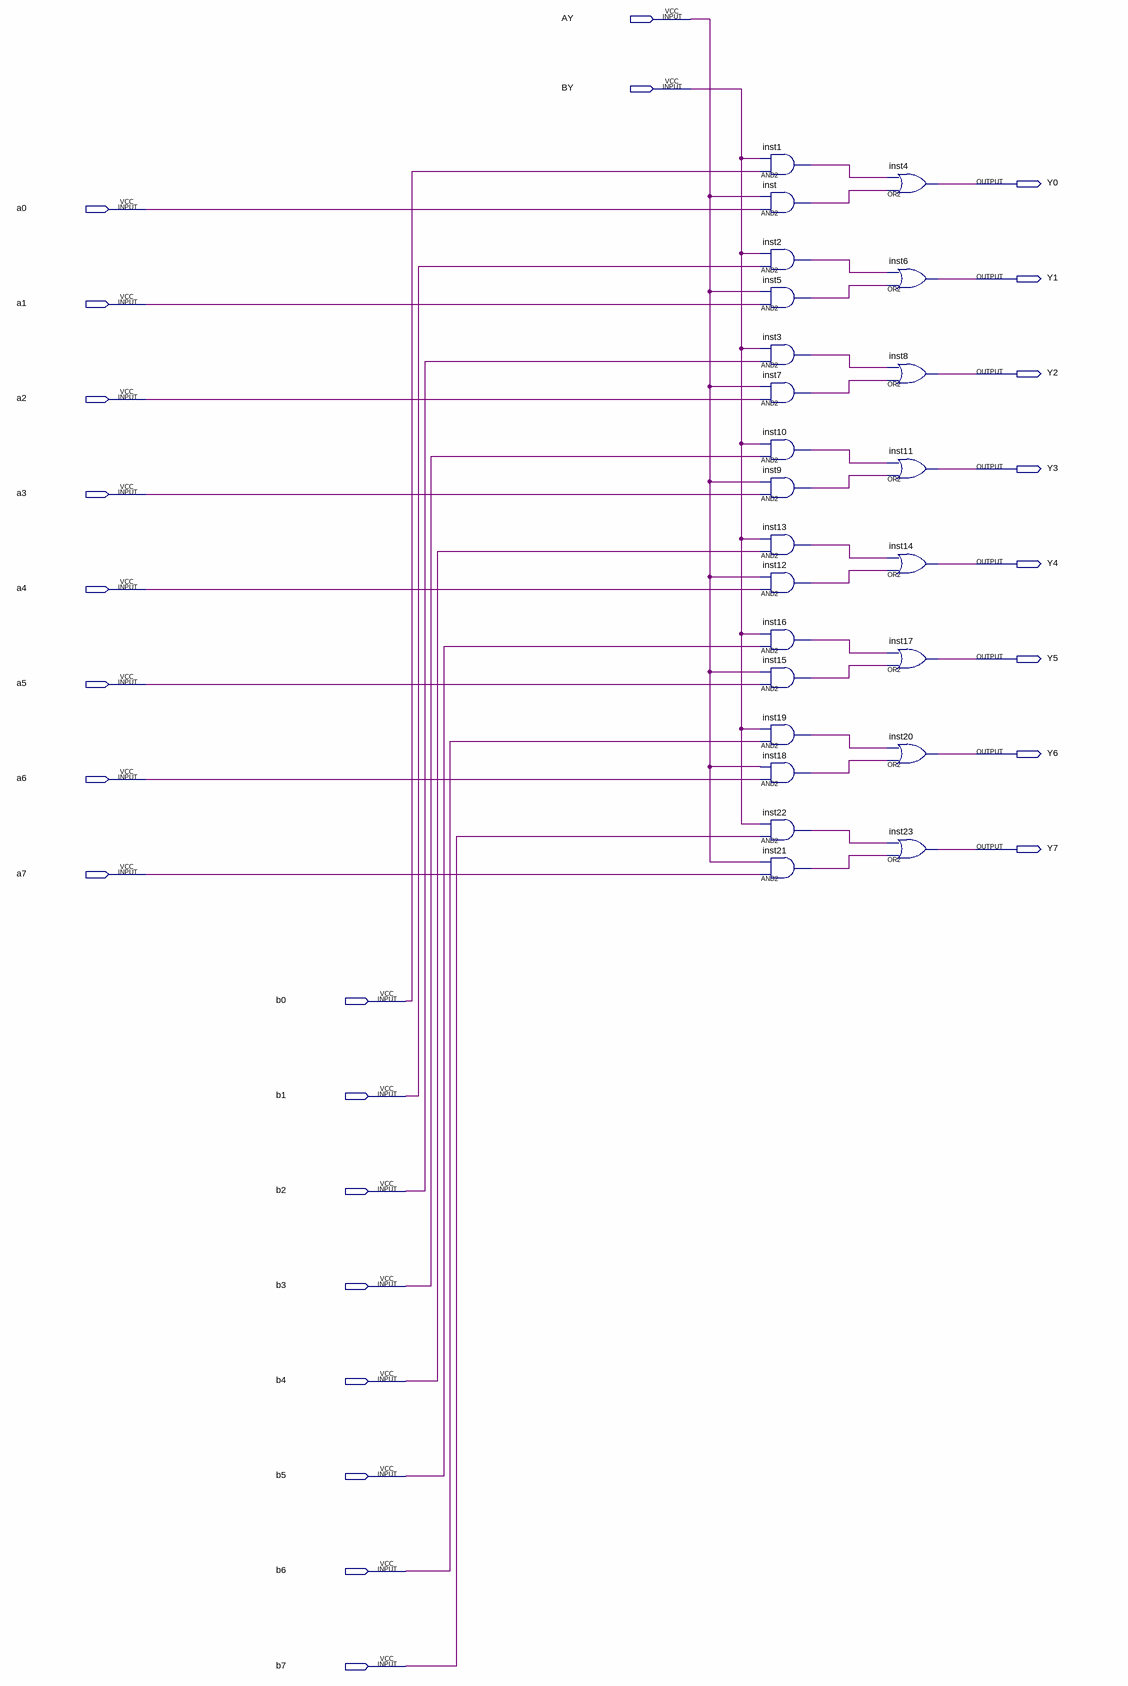
[diagram p0: schematic sheet]
// Quartus schematic selector.bdf as structural Verilog: 24 symbols, 26 pins
module selector (
  input  AY,
  input  BY,
  input  a0,
  input  a1,
  input  a2,
  input  a3,
  input  a4,
  input  a5,
  input  a6,
  input  a7,
  input  b0,
  input  b1,
  input  b2,
  input  b3,
  input  b4,
  input  b5,
  input  b6,
  input  b7,
  output Y0,
  output Y1,
  output Y2,
  output Y3,
  output Y4,
  output Y5,
  output Y6,
  output Y7
);

  wire inst1_out, inst2_out, inst3_out, inst5_out, inst7_out, inst9_out, inst10_out, inst12_out, inst13_out,
       inst15_out, inst16_out, inst18_out, inst19_out, inst21_out, inst22_out, inst_out;

  and inst1 (inst1_out, b0, BY);
  and inst (inst_out, a0, AY);
  and inst2 (inst2_out, b1, BY);
  and inst5 (inst5_out, a1, AY);
  and inst3 (inst3_out, b2, BY);
  and inst7 (inst7_out, a2, AY);
  and inst10 (inst10_out, b3, BY);
  and inst9 (inst9_out, a3, AY);
  and inst13 (inst13_out, b4, BY);
  and inst12 (inst12_out, a4, AY);
  and inst16 (inst16_out, b5, BY);
  and inst15 (inst15_out, a5, AY);
  and inst19 (inst19_out, b6, BY);
  and inst18 (inst18_out, a6, AY);
  and inst22 (inst22_out, b7, BY);
  and inst21 (inst21_out, a7, AY);
  or inst4 (Y0, inst_out, inst1_out);
  or inst6 (Y1, inst5_out, inst2_out);
  or inst8 (Y2, inst7_out, inst3_out);
  or inst11 (Y3, inst9_out, inst10_out);
  or inst14 (Y4, inst12_out, inst13_out);
  or inst17 (Y5, inst15_out, inst16_out);
  or inst20 (Y6, inst18_out, inst19_out);
  or inst23 (Y7, inst21_out, inst22_out);
endmodule
